# EasyEDA schematic SCH_Liftmaster-Direct-GDO_2024-10-29.json
TITLE: Chamgerlin/Liftmaster GDO Monitor; REV: 1.0; Date: 2024-07-01; Sheet: 1/1; Drawn By: czsmith; Company: Your Company
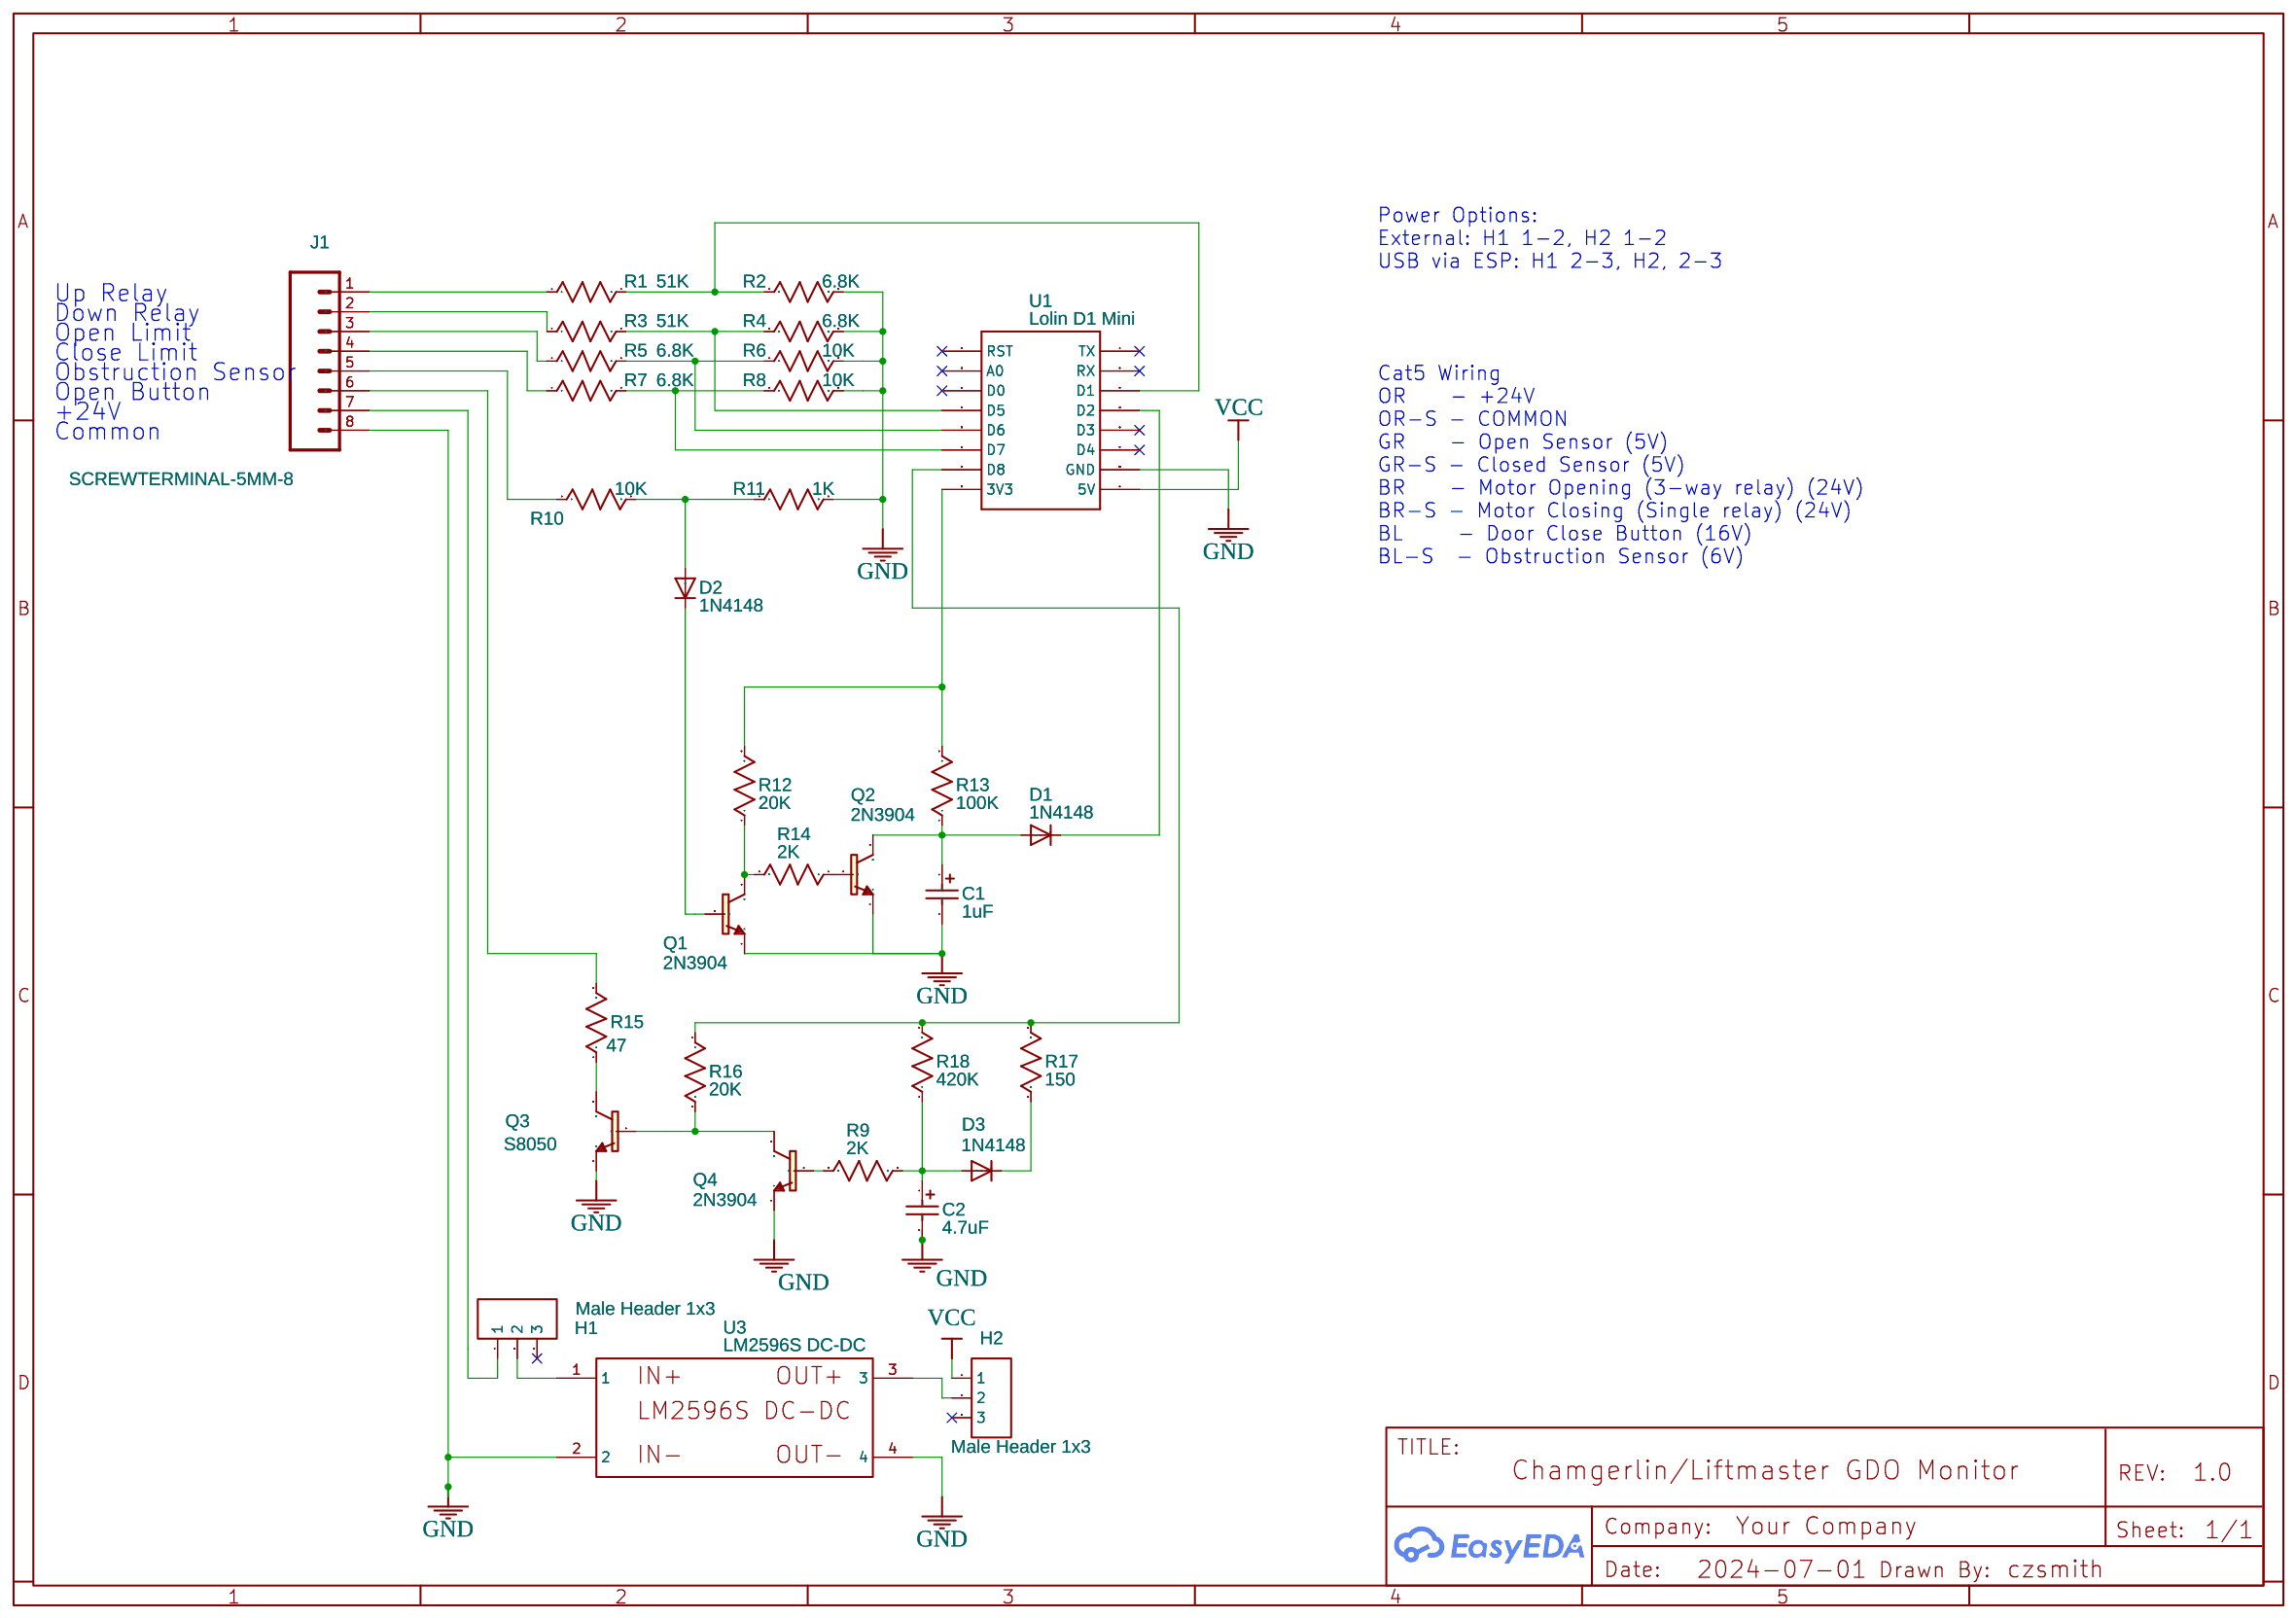
[diagram p0: schematic sheet]

## Parts
C1  1uF  [CAP-D5.0-F2.0]
C2  4.7uF  [CAP-D5.0-F2.0]
D1  1N4148  [DO-1N4148-SMITH]
D2  1N4148  [DO-1N4148-SMITH]
D3  1N4148  [DO-1N4148-SMITH]
H1  Male Header 1x3  [HDR-TH_3P-P2.54-V-M-1]
H2  Male Header 1x3  [HDR-TH_3P-P2.54-V-M-1]
J1  SCREWTERMINAL-5MM-8  [SCREWTERMINAL-5MM-8]
Q1  2N3904  [TO_92_SMITH]
Q2  2N3904  [TO_92_SMITH]
Q3  S8050  [TO_92_SMITH]
Q4  2N3904  [TO_92_SMITH]
R1  51K  [R-AXIAL-04]
R2  6.8K  [R-AXIAL-04]
R3  51K  [R-AXIAL-04]
R4  6.8K  [R-AXIAL-04]
R5  6.8K  [R-AXIAL-04]
R6  10K  [R-AXIAL-04]
R7  6.8K  [R-AXIAL-04]
R8  10K  [R-AXIAL-04]
R9  2K  [R-AXIAL-04]
R10  10K  [R-AXIAL-04]
R11  1K  [R-AXIAL-04]
R12  20K  [R-AXIAL-04]
R13  100K  [R-AXIAL-04]
R14  2K  [R-AXIAL-04]
R15  47  [R-AXIAL-04]
R16  20K  [R-AXIAL-04]
R17  150  [R-AXIAL-04]
R18  420K  [R-AXIAL-04]
U1  Lolin D1 Mini  [LOLIN D1 MINI]
U3  LM2596S DC-DC  [LM2596S-MODULE]

## Library data of the parts
C1 C2 = 1uF: Supplier: LCSC; Manufacturer: AVX; Manufacturer Part: TAP105K050SCS; Supplier Part: C52309
D1-D3 = DIODEDO-1N4148: Diode; Contributor: Adafruit
H1 H2 = Header-Male-2.54_1x3: Supplier: LCSC; Manufacturer: BOOMELE(博穆精密); Manufacturer Part: 2.54-1*3P针; Supplier Part: C49257; JLCPCB Part Class: Extended Part
J1 = SCREWTERMINAL-5MM-8: Contributor: rwumass
Q1-Q4 = TRANSISTOR_NPN2N3904: Generic NPN BJT; Contributor: SparkFun
R1-R18 = R_0603_US: Contributor: LCEDA_Lib
U1 = Lolin D1 Mini: sourceId: YemgaslDx; Contributor: Marco Cè
U3 = LM2596S DC-DC: Manufacturer Part: OZ0055; Supplier: QLOUNI; link: https://www.amazon.de/QLOUNI-LM2596-Converter-0-40V-Stromversorgung/dp/B077VW4BTY/ref=sr_1_1?__mk_de_DE=%C3%85M%C3%85%C5%BD%C3%95%C3%91&keywords=qlouni+lm2596&qid=1573110912&sr=8-1; Contributor: mrilic66

## Nets
GND: C1.2 C2.2 J1.8(1) Q1.1(E) Q2.1(E) Q3.1(E) Q4.1(E) R2.2 R4.2 R6.2 R8.2 R11.2 U1.GND U3.2 U3.4
VCC: H2.1 U1.5V
Net-(C1-1): C1.1 D1.A Q2.3(C) R13.1
Net-(C2-1): C2.1 D3.A R9.1 R18.1
Net-(D1-C): D1.C U1.D2
Net-(D2-A): D2.A R10.2 R11.1
Net-(D2-C): D2.C Q1.2(B)
Net-(D3-C): D3.C R17.1
Net-(H1-1): H1.1 J1.7(2)
Net-(H1-2): H1.2 U3.1
Net-(H2-2): H2.2 U3.3
Net-(J1-1): J1.1(8) R1.1
Net-(J1-2): J1.2(7) R3.1
Net-(J1-3): J1.3(6) R5.1
Net-(J1-4): J1.4(5) R7.1
Net-(J1-5): J1.5(4) R10.1
Net-(J1-6): J1.6(3) R15.2
Net-(Q1-3): Q1.3(C) R12.1 R14.2
Net-(Q2-2): Q2.2(B) R14.1
Net-(Q3-2): Q3.2(B) Q4.3(C) R16.2
Net-(Q3-3): Q3.3(C) R15.1
Net-(Q4-2): Q4.2(B) R9.2
Net-(R1-2): R1.2 R2.1 U1.D1
Net-(R3-2): R3.2 R4.1 U1.D5
Net-(R5-2): R5.2 R6.1 U1.D6
Net-(R7-2): R7.2 R8.1 U1.D7
Net-(R12-2): R12.2 R13.2 U1.3V3
Net-(R16-1): R16.1 R17.2 R18.2 U1.D8

Not connected (* = marked no-connect by the designer): H1 3*; H2 3*; U1 A0* D0* D3* D4* RST* RX* TX*

## Notes on the sheet
- Power Options:
  External: H1 1-2, H2 1-2
  USB via ESP: H1 2-3, H2, 2-3
- Down Relay
- Up Relay
- Open Limit
- Close Limit
- Obstruction Sensor
- Cat5 Wiring
  OR    - +24V
  OR-S - COMMON
  GR    - Open Sensor (5V)
  GR-S - Closed Sensor (5V)
  BR    - Motor Opening (3-way relay) (24V)
  BR-S - Motor Closing (Single relay) (24V)
  BL     - Door Close Button (16V)
  BL-S  - Obstruction Sensor (6V)
- Open Button
- +24V
- Common
